# Altium schematic sheet ATU_MCU.SchDoc: Приемопередатчик  SDR200
size 420 x 297 mm; Author: В.Титов; DrawnBy: В.Титов; DocumentNumber: ХХХХ.468179.001 Э3; SheetNumber: 1; SheetTotal: 3; DocumentType: Схема электрическая принципиальная; Title2: Согласующее устройство; Scale: 1:1
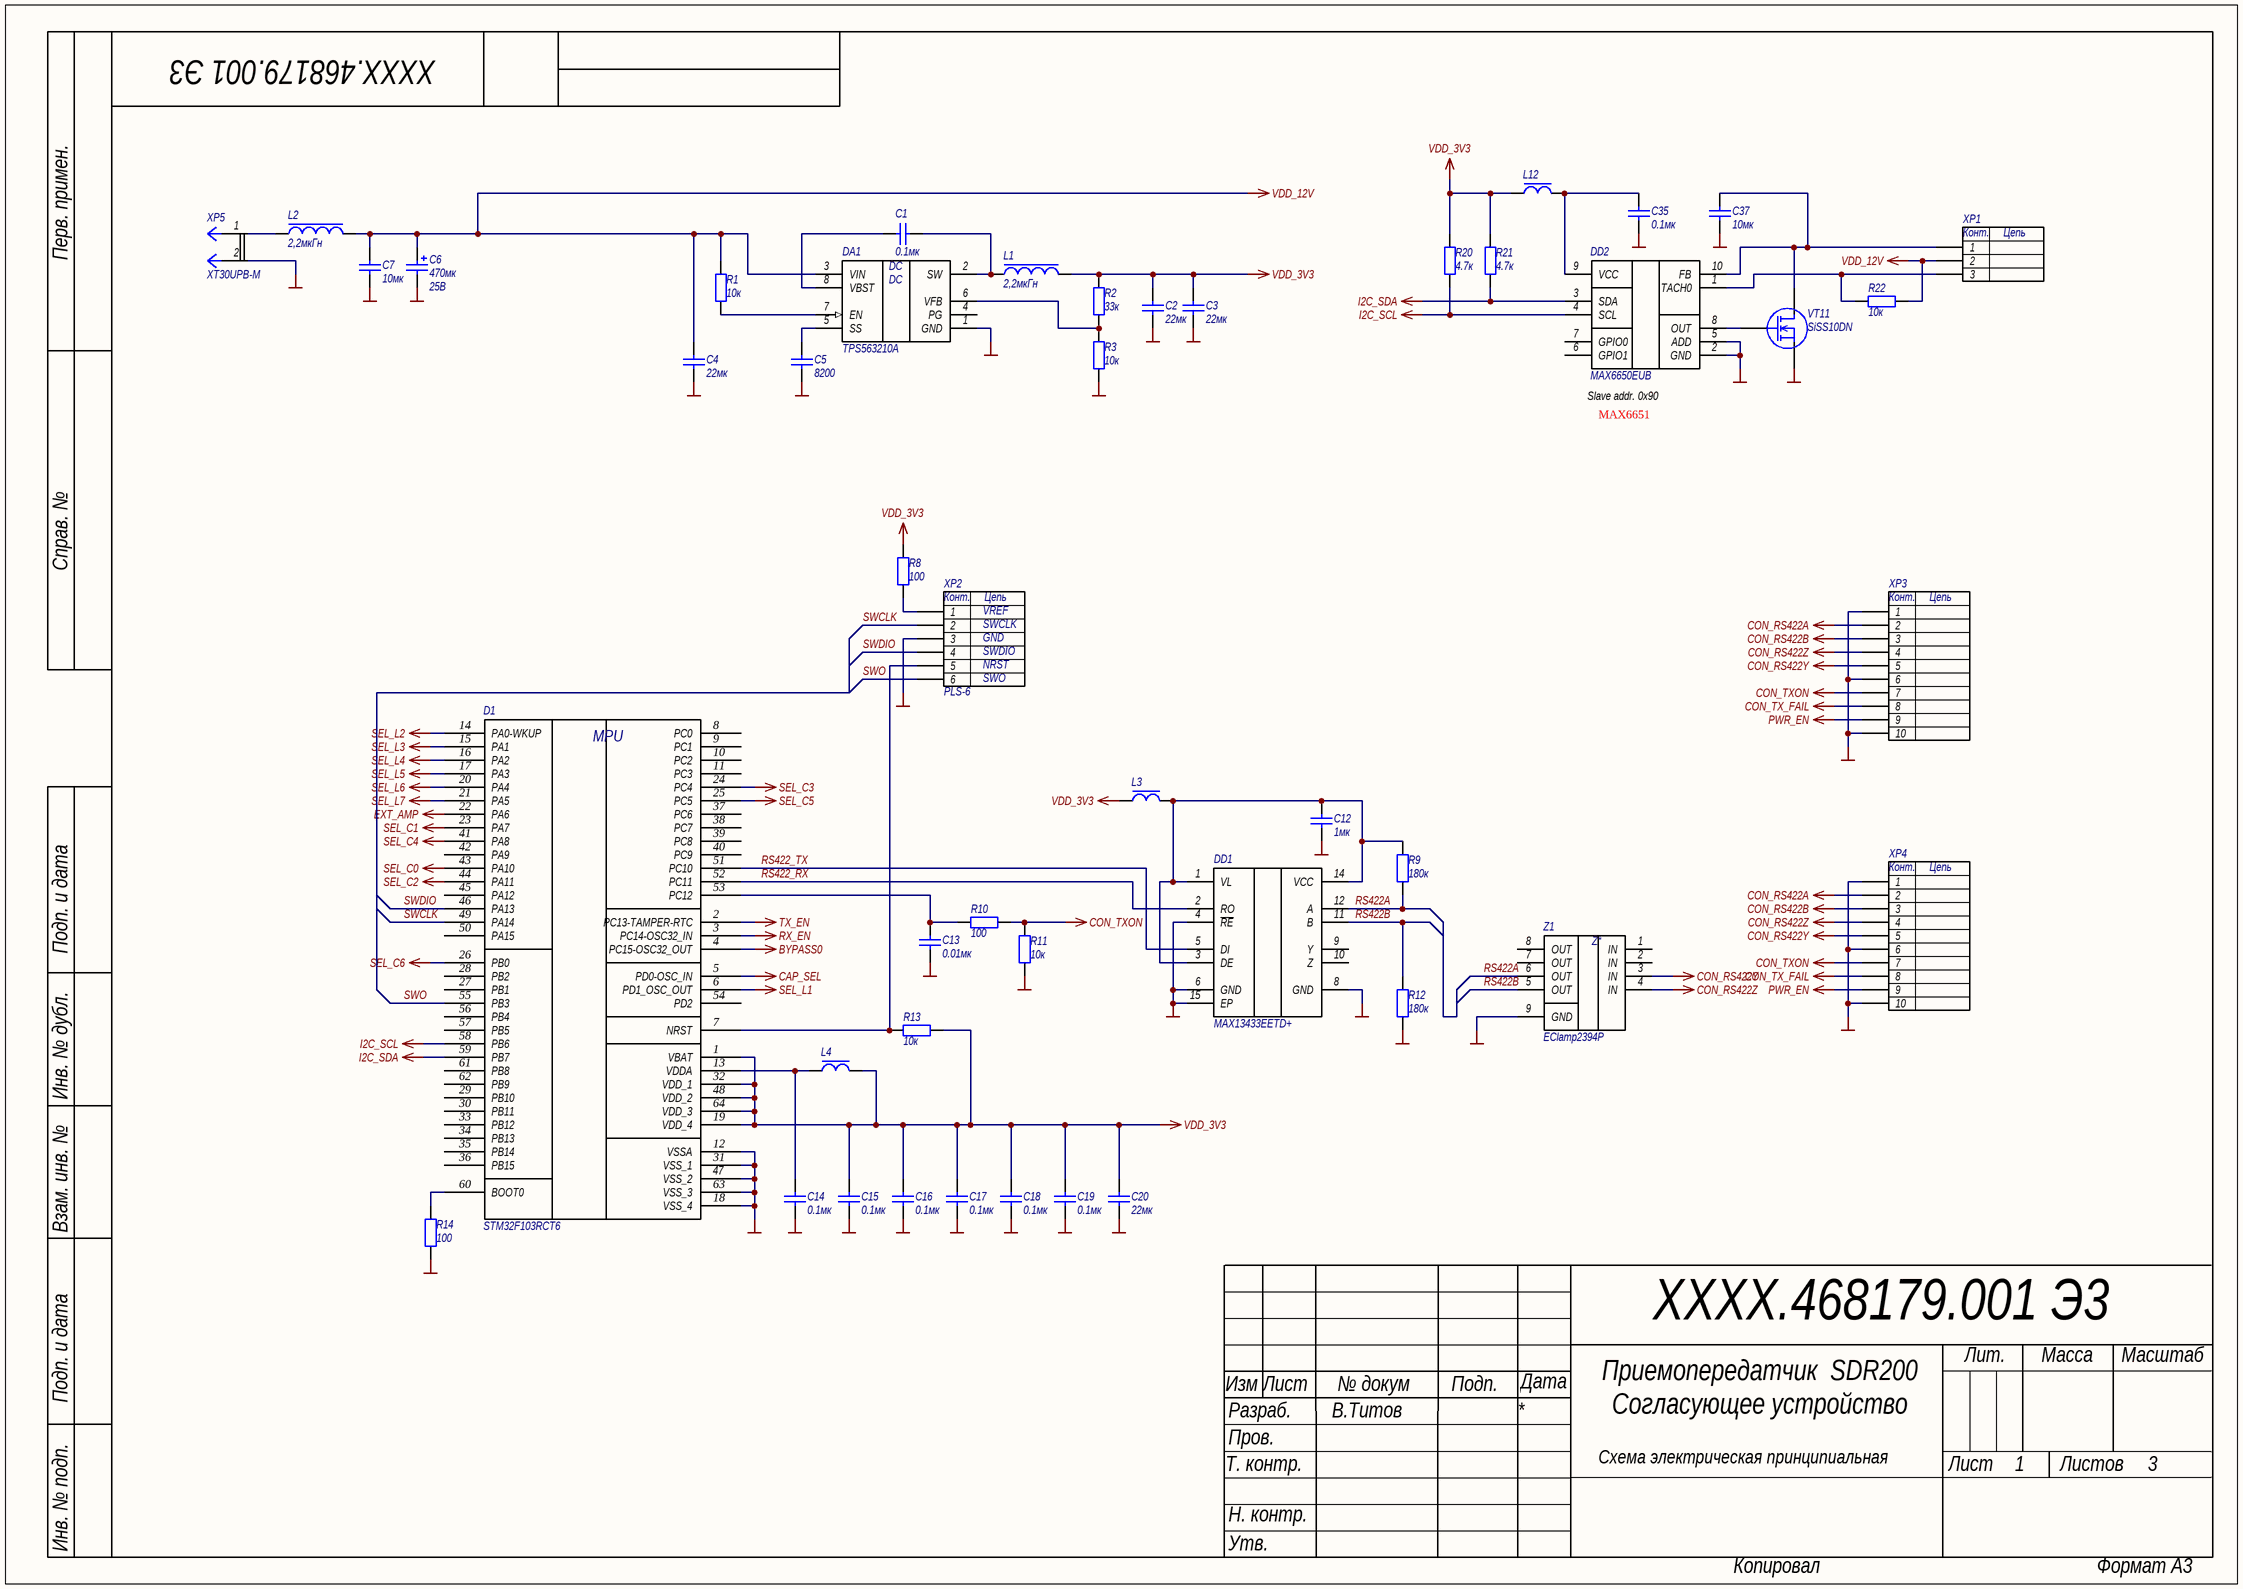
[diagram p0: ATU_MCU.SchDoc]

## Parts
C1  0.1мк  [CAPC1005X06N]
C2  22мк  [CAPC2012X12L]
C3  22мк  [CAPC2012X12L]
C4  22мк  [CAPC2012X12L]
C5  8200  [CAPC1005X06N]
C6  Power/Voltage: 25В  [CAPAE116103X105N]  (hidden comment: 470мк)
C7  10мк  [CAPC3225X27L]
C12  1мк  [CAPC1005X06N]
C13  0.01мк  [CAPC1005X06N]
C14  0.1мк  [CAPC1005X06N]
C15  0.1мк  [CAPC1005X06N]
C16  0.1мк  [CAPC1005X06N]
C17  0.1мк  [CAPC1005X06N]
C18  0.1мк  [CAPC1005X06N]
C19  0.1мк  [CAPC1005X06N]
C20  22мк  [CAPC2012X12L]
C35  0.1мк  [CAPC1005X06N]
C37  10мк  [CAPC3225X27L]
D1  STM32F103RCT6  [QFP50P1200X1200X160-64N]
DA1  TPS563210A  [TSOP65P280X110-8N]
DD1  MAX13433EETD+  [SON40P300X80_HS-15L]
DD2  MAX6650EUB  [SOP64P600X175-16N]
L1  2,2мкГн  [CSAB0420]
L2  2,2мкГн  [CSAB0420]
L3  BLM18PG121SN1D  [INDC1608X08L]  (value not drawn)
L4  BLM18PG121SN1D  [INDC1608X08L]  (value not drawn)
L12  BLM18PG121SN1D  [INDC1608X08L]  (value not drawn)
R1  10к  [RESC1005X06N]
R2  33к  [RESC1005X06N]
R3  10к  [RESC1005X06N]
R8  100  [RESC1005X06N]
R9  180к  [RESC1005X06N]
R10  100  [RESC1005X06N]
R11  10к  [RESC1005X06N]
R12  180к  [RESC1005X06N]
R13  10к  [RESC1005X06N]
R14  100  [RESC1005X06N]
R20  4.7к  [RESC1005X06N]
R21  4.7к  [RESC1005X06N]
R22  10к  [RESC1005X06N]
VT11  SiSS10DN  [PowerPAK_1212-8W]
XP1  22232031  [22232031]  (value not drawn)
XP2  PLS-6  [HDR1X6]
XP3  FH12-10S-0.5SVA  [FH12-10S-0.5SH]  (value not drawn)
XP4  FH12-10S-0.5SVA  [FH12-10S-0.5SH]  (value not drawn)
XP5  XT30UPB-M  [XT30UPB-M]
Z1  EClamp2394P  [SON50P160X65_HS-9N]

## Nets
BYPASS0: D1.4(PC15-OSC32_OUT)
CAP_SEL: D1.5(PD0-OSC_IN)
CON_RS422A: XP3.2 XP4.2
CON_RS422B: XP3.3 XP4.3
CON_RS422Y: XP3.5 XP4.5 Z1.3(IN)
CON_RS422Z: XP3.4 XP4.4 Z1.4(IN)
CON_TX_FAIL: XP3.8 XP4.8
CON_TXON: R10.1 R11.1 XP3.7 XP4.7
EXT_AMP: D1.22(PA6)
GND: C2.1 C3.1 C4.1 C5.1 C6.2 C7.1 C12.1 C13.1 C14.1 C15.1 C16.1 C17.1 C18.1 C19.1 C20.1 C35.1 C37.1 D1.12(VSSA) D1.18(VSS_4) D1.31(VSS_1) D1.47(VSS_2) D1.63(VSS_3) DA1.1(GND) DD1.4(~{RE}) DD1.6(GND) DD1.8(GND) DD1.15(EP) DD2.2(GND) DD2.5(ADD) R3.2 R11.2 R12.1 R14.2 VT11.S XP2.3 XP3.1 XP3.6 XP3.10 XP4.1 XP4.6 XP4.10 XP5.2 Z1.9(GND)
I2C_SCL: D1.58(PB6) DD2.4(SCL) R20.1
I2C_SDA: D1.59(PB7) DD2.3(SDA) R21.1
PWR_EN: XP3.9 XP4.9
RX_EN: D1.3(PC14-OSC32_IN)
SEL_C0: D1.43(PA10)
SEL_C1: D1.23(PA7)
SEL_C2: D1.44(PA11)
SEL_C3: D1.24(PC4)
SEL_C4: D1.41(PA8)
SEL_C5: D1.25(PC5)
SEL_C6: D1.26(PB0)
SEL_L1: D1.6(PD1_OSC_OUT)
SEL_L2: D1.14(PA0-WKUP)
SEL_L3: D1.15(PA1)
SEL_L4: D1.16(PA2)
SEL_L5: D1.17(PA3)
SEL_L6: D1.20(PA4)
SEL_L7: D1.21(PA5)
TX_EN: D1.2(PC13-TAMPER-RTC)
VDD_3V3: C2.2 C3.2 C15.2 C16.2 C17.2 C18.2 C19.2 C20.2 D1.1(VBAT) D1.19(VDD_4) D1.32(VDD_1) D1.48(VDD_2) D1.64(VDD_3) L1.2 L3.1 L4.2 L12.1 R2.2 R8.1 R13.2 R20.2 R21.2
VDD_12V: C4.2 C6.1 C7.2 DA1.3(VIN) L2.2 R1.2 R22.2 XP1.2
RS422_RX: D1.52(PC11) DD1.2(RO)
RS422_TX: D1.51(PC10) DD1.5(DI)
RS422A: DD1.12(A) R9.1 Z1.6(OUT)
RS422B: DD1.11(B) R12.2 Z1.5(OUT)
SWCLK: D1.49(PA14) XP2.2
SWDIO: D1.46(PA13) XP2.4
SWO: D1.55(PB3) XP2.6
NetC1_1: C1.1 DA1.2(SW) L1.1
NetC1_2: C1.2 DA1.8(VBST)
NetC5_2: C5.2 DA1.5(SS)
NetC12_2: C12.2 DD1.1(VL) DD1.3(DE) DD1.14(VCC) L3.2 R9.2
NetC13_2: C13.2 D1.53(PC12) R10.2
NetC14_2: C14.2 D1.13(VDDA) L4.1
NetC35_2: C35.2 DD2.9(VCC) L12.2
NetC37_2: C37.2 DD2.10(FB) VT11.D XP1.1
NetD1_7: D1.7(NRST) R13.1 XP2.5
NetD1_60: D1.60(BOOT0) R14.1
NetDA1_6: DA1.6(VFB) R2.1 R3.1
NetDA1_7: DA1.7(EN) R1.1
NetDD2_1: DD2.1(TACH0) R22.1 XP1.3
NetDD2_8: DD2.8(OUT) VT11.G
NetL2_1: L2.1 XP5.1
NetR8_2: R8.2 XP2.1

Not connected (* = marked no-connect by the designer): D1 8(PC0) 9(PC1) 10(PC2) 11(PC3) 27(PB1) 28(PB2) 29(PB10) 30(PB11) 33(PB12) 34(PB13) 35(PB14) 36(PB15) 37(PC6) 38(PC7) 39(PC8) 40(PC9) 42(PA9) 45(PA12) 50(PA15) 54(PD2) 56(PB4) 57(PB5) 61(PB8) 62(PB9); DA1 4(PG); DD1 9(Y) 10(Z); DD2 6(GPIO1) 7(GPIO0); Z1 1(IN) 2(IN) 7(OUT) 8(OUT)

## Notes on the sheet
- (near DD2) Slave addr. 0x90
- MAX6651
- (near XP2) VREF
- (near XP2) SWCLK
- (near XP2) GND
- (near XP2) SWDIO
- (near XP2) NRST
- (near XP2) SWO
- Перв. примен.
- Справ. №
- Подп. и дата
- Инв. № дубл.
- Взам. инв. №
- Изм
- Лист
- № докум
- Подп.
- Дата
- Лит.
- Масса
- Масштаб
- Т. контр.
- Разраб.
- Пров.
- Листов
- Н. контр.
- Инв. № подп.
- Утв.
- Копировал
- Формат А3
- (in symbol Микросхема STM32F103RCT6) MPU
- (in symbol Микросхема TPS563210A) DC
- (in symbol Соединитель 22232031) Конт.; Цепь
- (in symbol Соединитель FH12-10S-0.5SVA) Конт.; Цепь
- (in symbol Соединитель PLS-6) Конт.; Цепь
- (in symbol Фильтр EMI EClamp2394P) Z*

## Library data of the parts
C1 C14-C19 C35 = Кер.ЧИП конд. 0402 0.1мкФ X7R 10%, 16В: Кер. ЧИП-конденсатор; Power/Voltage: 16В; TKE: X7R; Tolerance: ±10%; PackageReference: 0402; Value: 0.1мк
C2-C4 C20 = Кер.ЧИП конд. 0805 22мкФ X5R 10% 16В: Кер. ЧИП-конденсатор; Manufacturer: TDK; ManufacturerPartNumber: C2012X5R1C226KT; Power/Voltage: 16В; TKE: X5R; Tolerance: ±10%; Value: 22мк
C5 = Кер.ЧИП конд. 0402 8200пФ X7R 10%, 50В: Кер. ЧИП-конденсатор; Power/Voltage: 50В; TKE: X7R; Tolerance: ±20%; Value: 8200
C6 = Конденсатор гибридный SMD 470мкФ ±20% 25В: Гибридный ЧИП-конденсатор; ManufacturerPartNumber: EEHZK1E471P; Manufacturer: Panasonic; Tolerance: ±20%; Published: 8-Jun-2000; LatestRevisionDate: 29-May-2009; LatestRevisionNote: IPC-7351 Footprint Added.; Publisher: Altium Limited; PackageDescription: ZK series; PackageReference: ZK series; Value: 470мк
C7 C37 = Кер.ЧИП конд. 1210 10мкФ X5R 20% 50В: Кер. ЧИП-конденсатор; Manufacturer: Murata; ManufacturerPartNumber: GRM32ER71H106; Power/Voltage: 50В; TKE: X5R; Tolerance: ±20%; Value: 10мк
C12 = Кер.ЧИП конд. 0402 1мкФ X5R 10%, 10В: Кер. ЧИП-конденсатор; Power/Voltage: 10В; TKE: X5R; Tolerance: ±10%; PackageReference: 0402; Value: 1мк
C13 = Кер.ЧИП конд. 0402 0.01мкФ X7R 10%, 50В: Кер. ЧИП-конденсатор; Power/Voltage: 50В; TKE: X7R; Tolerance: ±20%; Value: 0.01мк
D1 = Микросхема STM32F103RCT6: Ultra-low-power 32-bit MCU ARM®-based Cortex®-M3, 128KB Flash, 16KB SRAM, 4KB EEPROM, LCD, USB, ADC, DAC; Manufacturer: STMicroelectronics; Published: 29-Jan-2009; Code_JEDEC: MS-026; ComponentLink1Description: Manufacturer Link; ComponentLink3Description: Packaging Specification; Value: STM32F103RCT6
DA1 = Микросхема TPS563210A: TPS56x210A, 4.5-V to 17-V Input, 2-A, 3-A Synchrono; Manufacturer: TI; Value: TPS563210A
DD1 = Микросхема MAX13433EETD+: RS-422 Transceivers with Low-Voltage Logic Interface 16M; Manufacturer: Maxim; Value: MAX13433EETD+; ComponentLink1Description: datasheet; ComponentLink1URL: https://datasheets.maximintegrated.com/en/ds/MAX13430E-MAX13433E.pdf
DD2 = Микросхема MAX6650EUB: Fan-Speed Regulators and Monitors with SMBus/I2C-Compatible Interface; Manufacturer: Maxim; Value: MAX6650EUB; ComponentLink1Description: datasheet; ComponentLink1URL: https://www.analog.com/media/en/technical-documentation/data-sheets/MAX6650-MAX6651.pdf
L1 L2 = ЧИП индуктивность CSAB0420-2R2M: Molding Power Choke; Manufacturer: Vishay; ManufacturerPartNumber: IHLP1616ABER1R0M11; Value: 2,2мкГн
L3 L4 L12 = ЧИП дроссель 0603 BLM18PG121SN1D: SMD EMI Suppression Filter EMIFIL; Manufacturer: Murata; ManufacturerPartNumber: BLM18PG121SN1D; Value: BLM18PG121SN1D
R1 = Чип резистор 0402 10 кОм, 1%: ЧИП-резистор; Tolerance: ±5%; TKE: 100 ppm/°С; PackageReference: 0402; Value: 10к
R2 = Чип резистор 0402 33 кОм, 5%: ЧИП-резистор; Tolerance: ±5%; TKE: 100 ppm/°С; PackageReference: 0402; Value: 33к
R3 R11 R13 R22 = Чип резистор 0402 10 кОм, 5%: ЧИП-резистор; Tolerance: ±5%; TKE: 100 ppm/°С; PackageReference: 0402; Value: 10к
R8 R10 R14 = Чип резистор 0402 100 Ом, 5%: ЧИП-резистор; Tolerance: ±5%; TKE: 100 ppm/°С; PackageReference: 0402; Value: 100
R9 R12 = Чип резистор 0402 180 кОм, 5%: ЧИП-резистор; Tolerance: ±5%; TKE: 100 ppm/°С; PackageReference: 0402; Value: 180к
R20 R21 = Чип резистор 0402 4,7 кОм, 5%: ЧИП-резистор; Tolerance: ±5%; TKE: 100 ppm/°С; PackageReference: 0402; Value: 4.7к
VT11 = ЧИП транзистор SiSS10DN: N-Channel 40 V (D-S) MOSFET; ComponentLink1Description: datasheet; ComponentLink1URL: https://www.vishay.com/docs/65439/siss10dn.pdf; Value: SiSS10DN
XP1 = Соединитель 22232031: Molex 2,54 мм pitch-3; Manufacturer: Connfly; Value: 22232031
XP2 = Соединитель PLS-6: Вилка штыревая 2.54мм 1x6 прямая тип1; LatestRevisionDate: 17-Jul-2002; LatestRevisionNote: Re-released for DXP Platform.; Publisher: Altium Limited; Value: PLS-6
XP3 XP4 = Соединитель FH12-10S-0.5SVA: 0.5mm  Pitch FPC/FFC Connector FH12 Series; Manufacturer: Hirose; Value: FH12-10S-0.5SVA
XP5 = Соединитель XT30UPB-M: AMASS XT30UPB-M  5 mm; Value: XT30UPB-M
Z1 = Фильтр EMI EClamp2394P: ESD/EMI Protection  for Color LCD Interfaces; Manufacturer: SEMTECH; PackageReference: SLP2116P8; Value: EClamp2394P